# EAGLE design mult-mixer (EAGLE 9.1.0)
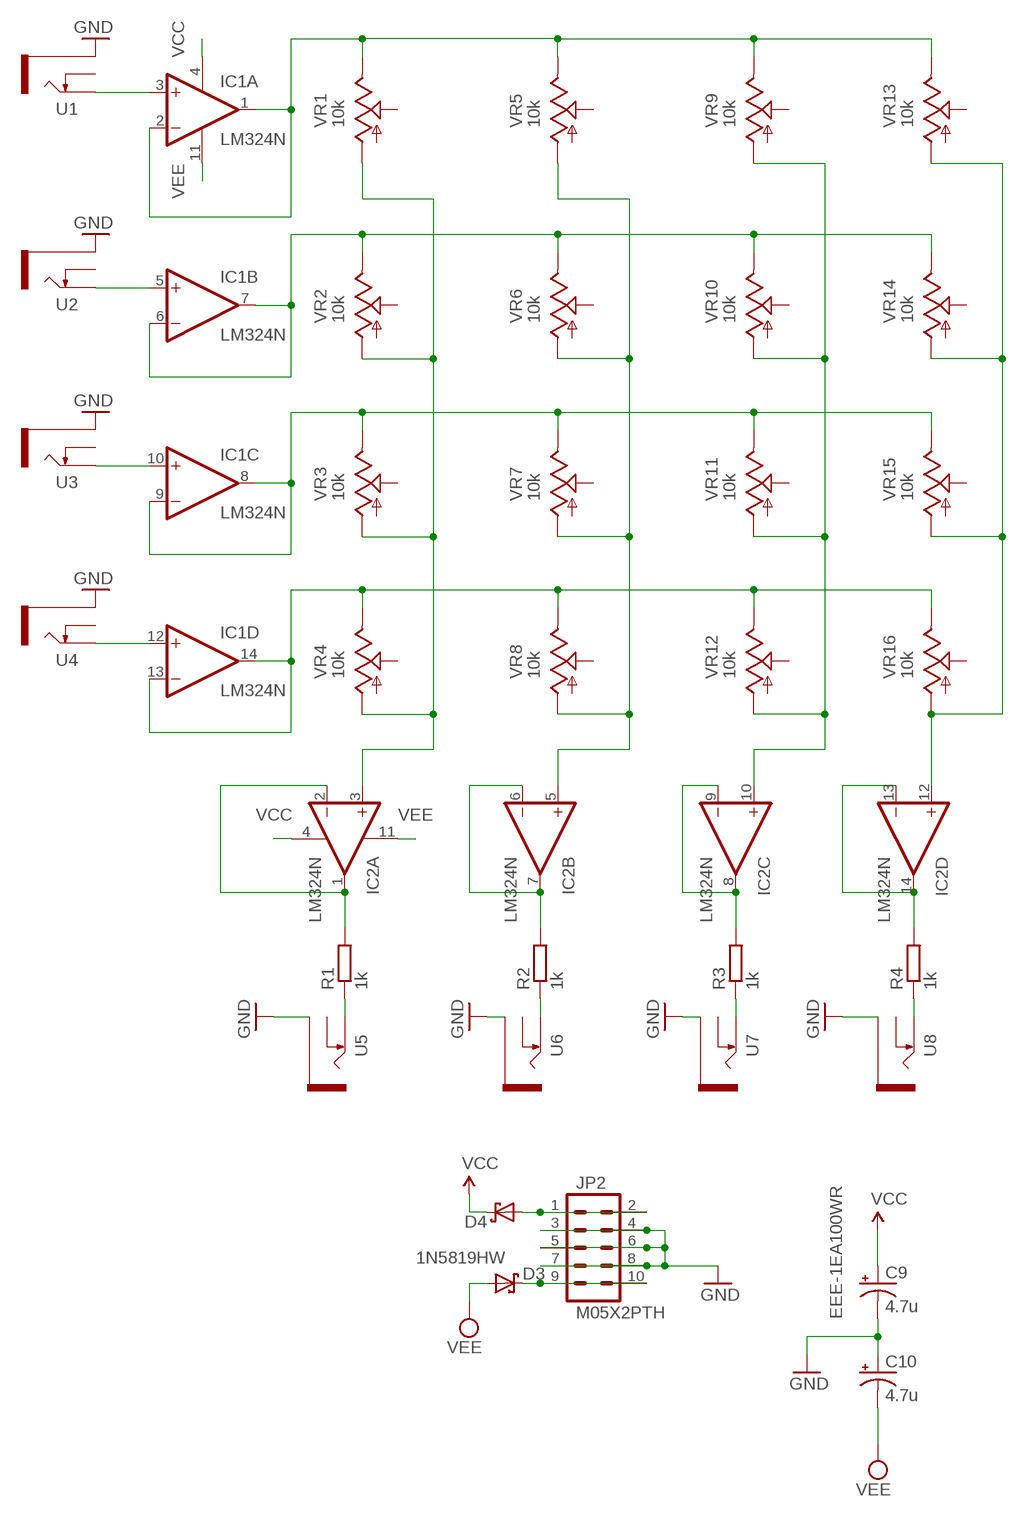
[diagram p0: schematic, sheet 1]

## Parts
C9  4.7u  CPOL-USA  [PANASONIC_A]
C10  4.7u  CPOL-USA  [PANASONIC_A]
D3  1N5819HW  1N5819-B  [DO41-7.6]
D4  1N5819HW  1N5819-B  [DO41-7.6]
IC1  LM324N  [DIL14]
IC2  LM324N  [DIL14]
JP2  M05X2PTH  [AVR_ICSP]
R1  1k  RESISTOR10MM_RESISTOR  [10MM_RESISTOR]
R2  1k  RESISTOR10MM_RESISTOR  [10MM_RESISTOR]
R3  1k  RESISTOR10MM_RESISTOR  [10MM_RESISTOR]
R4  1k  RESISTOR10MM_RESISTOR  [10MM_RESISTOR]
U1  THONKICONNNEW  [WQP-PJ301M-12_JACK]
U2  THONKICONNNEW  [WQP-PJ301M-12_JACK]
U3  THONKICONNNEW  [WQP-PJ301M-12_JACK]
U4  THONKICONNNEW  [WQP-PJ301M-12_JACK]
U5  THONKICONNNEW  [WQP-PJ301M-12_JACK]
U6  THONKICONNNEW  [WQP-PJ301M-12_JACK]
U7  THONKICONNNEW  [WQP-PJ301M-12_JACK]
U8  THONKICONNNEW  [WQP-PJ301M-12_JACK]
VR1  10k  9MM_SNAP-IN_POT_  [9MM_SNAP-IN_POT]
VR2  10k  9MM_SNAP-IN_POT_  [9MM_SNAP-IN_POT]
VR3  10k  9MM_SNAP-IN_POT_  [9MM_SNAP-IN_POT]
VR4  10k  9MM_SNAP-IN_POT_  [9MM_SNAP-IN_POT]
VR5  10k  9MM_SNAP-IN_POT_  [9MM_SNAP-IN_POT]
VR6  10k  9MM_SNAP-IN_POT_  [9MM_SNAP-IN_POT]
VR7  10k  9MM_SNAP-IN_POT_  [9MM_SNAP-IN_POT]
VR8  10k  9MM_SNAP-IN_POT_  [9MM_SNAP-IN_POT]
VR9  10k  9MM_SNAP-IN_POT_  [9MM_SNAP-IN_POT]
VR10  10k  9MM_SNAP-IN_POT_  [9MM_SNAP-IN_POT]
VR11  10k  9MM_SNAP-IN_POT_  [9MM_SNAP-IN_POT]
VR12  10k  9MM_SNAP-IN_POT_  [9MM_SNAP-IN_POT]
VR13  10k  9MM_SNAP-IN_POT_  [9MM_SNAP-IN_POT]
VR14  10k  9MM_SNAP-IN_POT_  [9MM_SNAP-IN_POT]
VR15  10k  9MM_SNAP-IN_POT_  [9MM_SNAP-IN_POT]
VR16  10k  9MM_SNAP-IN_POT_  [9MM_SNAP-IN_POT]

## Nets
GND: C9.- C10.+ JP2.3 JP2.4 JP2.5 JP2.6 JP2.7 JP2.8 U1.P$3_SLEEVE(SLEEVE) U2.P$3_SLEEVE(SLEEVE) U3.P$3_SLEEVE(SLEEVE) U4.P$3_SLEEVE(SLEEVE) U5.P$3_SLEEVE(SLEEVE) U6.P$3_SLEEVE(SLEEVE) U7.P$3_SLEEVE(SLEEVE) U8.P$3_SLEEVE(SLEEVE)
N$1: IC1.3(A:+IN) U1.P$1_TIP(TIP)
N$2: IC1.1(A:OUT) IC1.2(A:-IN) VR1.3(E) VR5.3(E) VR9.3(E) VR13.3(E)
N$3: IC1.5(B:+IN) U2.P$1_TIP(TIP)
N$4: IC1.10(C:+IN) U3.P$1_TIP(TIP)
N$5: IC1.12(D:+IN) U4.P$1_TIP(TIP)
N$7: IC1.6(B:-IN) IC1.7(B:OUT) VR2.3(E) VR6.3(E) VR10.3(E) VR14.3(E)
N$8: IC2.3(A:+IN) VR1.1(A) VR2.1(A) VR3.1(A) VR4.1(A)
N$9: IC2.1(A:OUT) IC2.2(A:-IN) R1.2
N$10: IC1.8(C:OUT) IC1.9(C:-IN) VR3.3(E) VR7.3(E) VR11.3(E) VR15.3(E)
N$11: IC1.13(D:-IN) IC1.14(D:OUT) VR4.3(E) VR8.3(E) VR12.3(E) VR16.3(E)
N$12: IC2.5(B:+IN) VR5.1(A) VR6.1(A) VR7.1(A) VR8.1(A)
N$13: IC2.6(B:-IN) IC2.7(B:OUT) R2.2
N$14: IC2.10(C:+IN) VR9.1(A) VR10.1(A) VR11.1(A) VR12.1(A)
N$15: IC2.8(C:OUT) IC2.9(C:-IN) R3.2
N$16: IC2.12(D:+IN) VR13.1(A) VR14.1(A) VR15.1(A) VR16.1(A)
N$17: IC2.13(D:-IN) IC2.14(D:OUT) R4.2
N$18: R1.1 U5.P$1_TIP(TIP)
N$19: R2.1 U6.P$1_TIP(TIP)
N$21: R3.1 U7.P$1_TIP(TIP)
N$22: R4.1 U8.P$1_TIP(TIP)
N$23: D4.A JP2.1 JP2.2
N$24: D3.C JP2.9 JP2.10
VCC: C9.+ D4.C IC1.4(P:V+) IC2.4(P:V+)
VEE: C10.- D3.A IC1.11(P:V-) IC2.11(P:V-)
Unconnected: U1.P$2_SWITCH(SWITCH) U2.P$2_SWITCH(SWITCH) U3.P$2_SWITCH(SWITCH) U4.P$2_SWITCH(SWITCH) U5.P$2_SWITCH(SWITCH) U6.P$2_SWITCH(SWITCH) U7.P$2_SWITCH(SWITCH) U8.P$2_SWITCH(SWITCH) VR1.2(S) VR2.2(S) VR3.2(S) VR4.2(S) VR5.2(S) VR6.2(S) VR7.2(S) VR8.2(S) VR9.2(S) VR10.2(S) VR11.2(S) VR12.2(S) VR13.2(S) VR14.2(S) VR15.2(S) VR16.2(S)

## Notes on the sheet
- EEE-1EA100WR

## Library data of the parts
C9 C10 = rcl:CPOL-US: POLARIZED CAPACITOR, American symbol
D3 D4 = diode:1N581*: 1.0A SCHOTTKY BARRIER RECTIFIER Source: http://www.diodes.com/datasheets/ds23001.pdf
IC1 IC2 = linear:LM324: OP AMP
JP2 = og-header:M05X2: Header 5x2 Standard 10-pin dual row 0.1" header. Commonly used with AVR-ISP. Use with Spark Fun Electronics SKU: PRT-00778
R1-R4 = MusicThingModular:RESISTOR: Standard resistor, various versions
U1-U8 = MusicThingModular:THONKICONN: 3.5mm socket for Eurorack modular synths
VR1-VR16 = MusicThingModular:9MM_SNAP-IN_POT: 9mm vertical snap-in pot, Alpha / Panasonic style

## Board
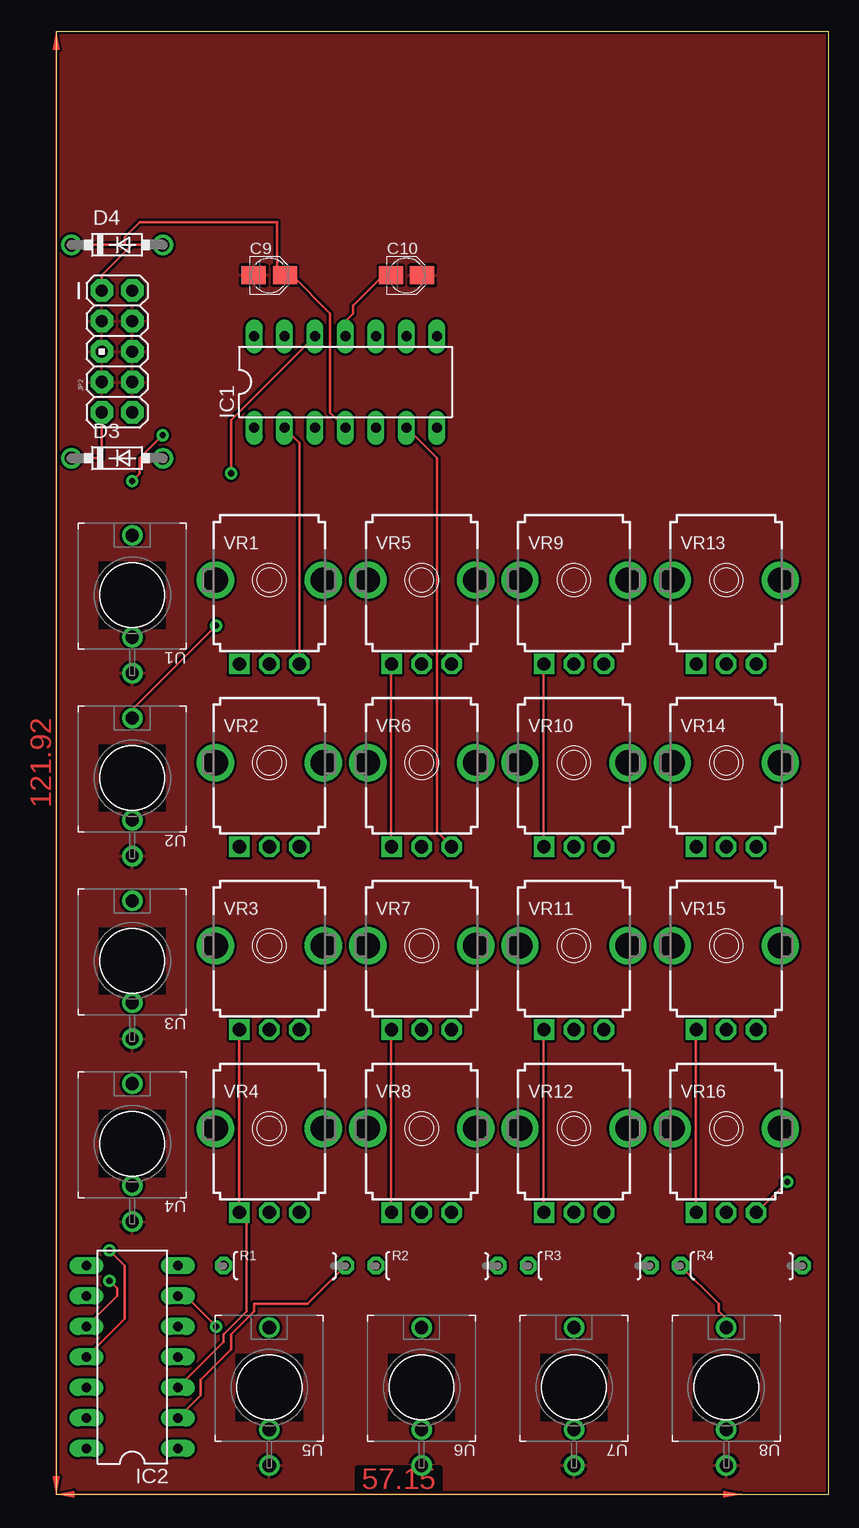
[diagram p1: board, top side]
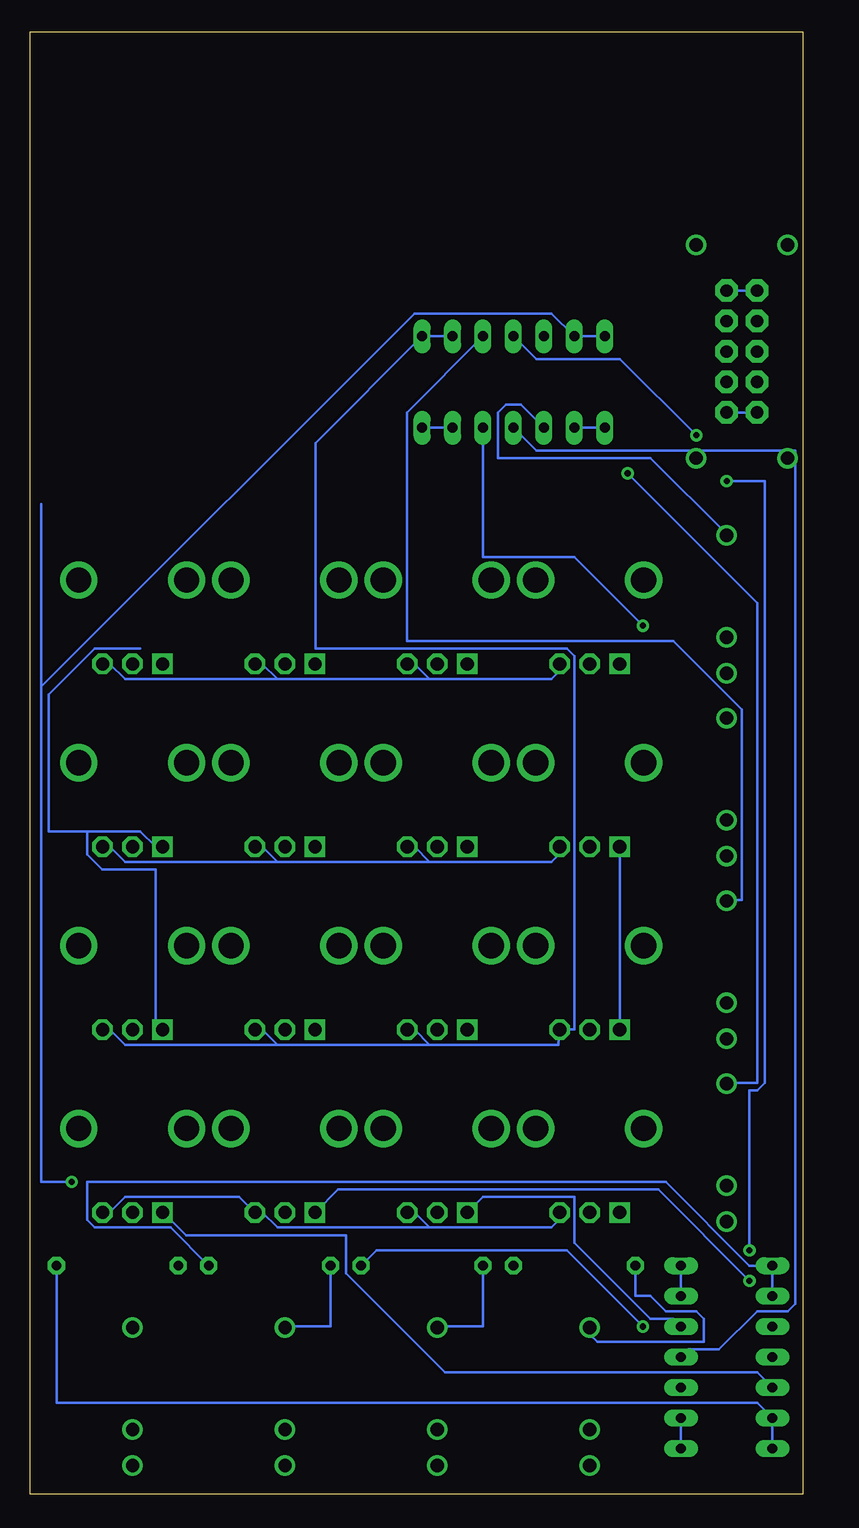
[diagram p2: board, bottom side, seen from below]

Size 64.44 x 121.91 mm. Coordinates in mm from the lower left corner, seen from the top.
Outline: 0,0 64.44,0 64.44,121.91 0,121.91 0,0
Copper layers (1*16): Top 0.035mm / dielectric 1.5mm / Bottom 0.035mm
Design rules "SparkFun": minimum track width 8mil, minimum drill 20mil, track to track 8mil, track to pad 8mil, pad to pad 8mil, via to via 8mil, smd to smd 8mil, copper to edge 8mil, drill to drill 8mil, minimum pad ring 12mil, minimum via ring 10mil, stop-mask expansion 4mil, vias tented up to drill 20mil, thermal gap 10mil

### Footprints (pad centres in the part's own frame; a part is rotated, then mirrored left to right if it is on the bottom)
PANASONIC_A = smd 2 x 1.5: + 1.3,0; - -1.3,0
DO41-7.6 = drill 1.1 pad 1.7: A 3.81,0; C -3.81,0
DIL14 = drill 0.813 long: 1 -7.62,-3.81; 2 -5.08,-3.81; 3 -2.54,-3.81; 4 0,-3.81; 5 2.54,-3.81; 6 5.08,-3.81; 7 7.62,-3.81; 8 7.62,3.81; 9 5.08,3.81; 10 2.54,3.81; 11 0,3.81; 12 -2.54,3.81; 13 -5.08,3.81; 14 -7.62,3.81
AVR_ICSP = drill 1.016 pad 1.88 octagon: 1 -1.27,5.08; 2 1.27,5.08; 3 -1.27,2.54; 4 1.27,2.54; 5 -1.27,0; 6 1.27,0; 7 -1.27,-2.54; 8 1.27,-2.54; 9 -1.27,-5.08; 10 1.27,-5.08
10MM_RESISTOR = drill 0.813 octagon: 1 -5.08,0; 2 5.08,0
WQP-PJ301M-12_JACK = drill 1.1: P$1_TIP 0,5; P$2_SWITCH 0,-3.5; P$3_SLEEVE 0,-6.5
9MM_SNAP-IN_POT = drill 1.1 square: 1 -2.5,-7 | drill 1.1 octagon: 2 0,-7; 3 2.5,-7 | drill 2.1 pad 2.794: CHASSIS1 -4.5,0; CHASSIS2 4.5,0

### Placement (x,y rotation side)
C9  17.78,101.6 0 top
C10  29.21,101.6 0 top
D3  5.08,86.36 0 top
D4  5.08,104.14 0 top
IC1  24.13,92.71 0 top
IC2  6.35,11.43 90 top
JP2  5.08,95.25 0 top
R1  19.05,19.05 0 top
R2  31.75,19.05 0 top
R3  44.45,19.05 0 top
R4  57.15,19.05 0 top
U1  6.35,74.93 0 top
U2  6.35,59.69 0 top
U3  6.35,44.45 0 top
U4  6.35,29.21 0 top
U5  17.78,8.89 0 top
U6  30.48,8.89 0 top
U7  43.18,8.89 0 top
U8  55.88,8.89 0 top
VR1  17.78,76.2 0 top
VR2  17.78,60.96 0 top
VR3  17.78,45.72 0 top
VR4  17.78,30.48 0 top
VR5  30.48,76.2 0 top
VR6  30.48,60.96 0 top
VR7  30.48,45.72 0 top
VR8  30.48,30.48 0 top
VR9  43.18,76.2 0 top
VR10  43.18,60.96 0 top
VR11  43.18,45.72 0 top
VR12  43.18,30.48 0 top
VR13  55.88,76.2 0 top
VR14  55.88,60.96 0 top
VR15  55.88,45.72 0 top
VR16  55.88,30.48 0 top

### Tracks (layer width: path | path; a pad name or v marks a point on that pad's centre or on a via)
GND
  pour Top: 0,121.92 0,0 64.77,0 64.77,121.92
N$1
  Bottom 0.203: IC1.3 23.5,90.81 24.77,90.81 25.4,90.17 25.4,86.36 12.7,86.36 6.35,80.01 U1.P$1_TIP
N$2
  Top 0.203: IC1.2 20.32,87.63 20.32,69.22 VR1.3
  Bottom 0.203: IC1.2 IC1.1 | 31.11,67.94 20.95,67.94 20.32,68.58 VR1.3 | 31.11,67.94 32.38,69.22 VR5.3 | 43.81,67.94 45.09,69.22 VR9.3 | 31.11,67.94 43.81,67.94 | 43.81,67.94 56.52,67.94 57.78,69.22 VR13.3
N$3  (via drill 0.51)
  Top 0.203: v13.34,72.39 6.35,65.41 U2.P$1_TIP
  Bottom 0.203: IC1.5 26.67,78.11 19.05,78.11 v13.34,72.39
N$4
  Bottom 0.203: IC1.10 33.02,90.17 33.02,71.12 10.79,71.12 5.08,65.41 5.08,49.53 6.35,49.53 U3.P$1_TIP
N$5  (via drill 0.51)
  Top 0.203: IC1.12 14.61,89.53 v14.61,85.09
  Bottom 0.203: v14.61,85.09 3.81,74.3 3.81,34.29 6.35,34.29 U4.P$1_TIP
N$7
  Top 0.203: IC1.6 31.75,86.36 31.75,55.24 32.38,54.61 32.38,53.98 VR6.3
  Bottom 0.203: IC1.7 IC1.6 | 31.11,52.7 20.95,52.7 20.32,53.34 VR2.3 | 31.11,52.7 32.38,53.98 VR6.3 | 43.81,52.7 45.09,53.98 VR10.3 | 31.11,52.7 43.81,52.7 | 43.81,52.7 56.52,52.7 57.78,53.98 VR14.3
N$8
  Top 0.203: IC2.3 13.97,12.7 13.97,13.34 15.88,15.24 15.88,22.86 VR4.1 VR3.1
  Bottom 0.203: VR3.1 15.24,38.73 15.24,53.34 VR2.1
N$9
  Top 0.203: R1.2 20.95,15.88 16.51,15.88 16.51,15.24 14.61,13.34 14.61,12.06 12.06,9.53 12.06,8.26 IC2.2
  Bottom 0.203: IC2.2 IC2.1
N$10
  Bottom 0.203: IC1.9 IC1.8 40.64,87.63 40.64,70.48 19.68,70.48 19.05,69.85 19.05,38.73 19.68,38.73 VR3.3 20.36,37.47 31.11,37.47 | 31.11,37.47 32.38,38.73 VR7.3 | 43.81,37.47 45.09,38.73 VR11.3 | 31.11,37.47 43.81,37.47 | 43.81,37.47 56.52,37.47 57.78,38.73 VR15.3
N$11  (via drill 0.51)
  Top 0.203: v60.96,26.04 58.42,23.5 VR16.3
  Bottom 0.203: IC1.14 IC1.13 20.95,98.42 32.38,98.42 63.5,67.31 63.5,26.04 | 31.11,22.23 20.95,22.23 20.32,22.86 VR4.3 | 31.11,22.23 32.38,23.5 VR8.3 | 31.11,22.23 43.81,22.23 45.09,23.5 VR12.3 45.72,23.5 46.99,24.77 56.52,24.77 57.78,23.5 VR16.3 | v60.96,26.04 63.5,26.04 | 63.5,26.04 63.5,82.55
N$12
  Top 0.203: VR7.1 27.94,38.1 27.94,23.5 VR8.1 | VR5.1 27.94,68.58 27.94,53.98 VR6.1
  Bottom 0.203: IC2.5 10.79,14.61 12.7,14.61 19.05,20.95 19.05,24.77 26.67,24.77 27.94,23.5 VR8.1
N$13  (via drill 0.51)
  Top 0.203: v13.34,13.97 10.79,16.51 IC2.6
  Bottom 0.203: IC2.7 IC2.6 | R2.2 35.56,20.32 19.68,20.32 v13.34,13.97
N$14  (via drill 0.51)
  Top 0.203: IC2.10 5.08,16.51 5.08,17.14 v4.45,17.78 | VR11.1 40.64,38.1 40.64,23.5 VR12.1 | VR9.1 40.64,68.58 40.64,53.98 VR10.1
  Bottom 0.203: v4.45,17.78 12.06,25.4 38.73,25.4 40.64,23.5 VR12.1
N$15
  Bottom 0.203: IC2.9 IC2.8 4.45,19.05 11.43,26.04 59.69,26.04 59.69,22.86 59.05,22.23 52.7,22.23 R3.2
N$16
  Top 0.203: VR15.1 53.34,38.1 53.34,23.5 VR16.1
  Bottom 0.203: 59.69,55.24 59.69,53.34 58.42,52.07 53.98,52.07 53.98,38.73 VR15.1 | 59.69,55.24 55.24,55.24 53.98,53.98 VR14.1 | 55.24,70.48 59.05,70.48 62.87,66.67 62.87,55.24 59.69,55.24 | IC2.12 3.81,10.16 29.84,10.16 38.1,18.41 38.1,21.59 51.44,21.59 52.7,22.86 53.34,22.86 VR16.1
N$17
  Bottom 0.203: IC2.14 IC2.13 3.81,7.62 62.23,7.62 R4.2
N$18
  Bottom 0.203: R1.1 13.97,16.51 12.7,16.51 11.43,15.24 8.89,15.24 8.26,14.61 8.26,12.7 17.14,12.7 17.78,13.34 U5.P$1_TIP
N$19
  Bottom 0.203: R2.1 26.67,13.97 30.48,13.97 U6.P$1_TIP
N$21
  Bottom 0.203: R3.1 39.37,13.97 43.18,13.97 U7.P$1_TIP
N$22
  Top 0.203: R4.1 55.24,15.88 55.24,15.24 55.88,14.61 U8.P$1_TIP
N$23
  Top 0.203: JP2.1 3.81,101.6 6.35,104.14 D4.A
  Bottom 0.203: JP2.1 JP2.2
N$24
  Top 0.203: JP2.9 3.81,86.36 D3.C
  Bottom 0.203: JP2.9 JP2.10
VCC
  Top 0.203: D4.C 5.71,104.14 5.71,104.78 6.99,106.05 18.41,106.05 18.41,102.23 19.05,101.6 C9.+ 19.68,101.6 22.86,98.42 22.86,90.17 IC1.4
  Bottom 0.203: IC2.4 9.53,12.06 6.99,12.06 3.81,15.24 1.27,15.24 0.64,15.88 0.64,87 | 0.64,87 22.23,87 IC1.4 | 0.64,87 0.64,31.11
VEE  (via drill 0.51)
  Top 0.203: v8.89,88.27 6.99,86.36 | IC1.11 24.13,97.79 24.77,98.42 24.77,99.06 27.3,101.6 C10.- | IC2.11 5.71,14.61 5.71,19.05 v4.45,20.32 | v6.35,84.45 6.99,85.09 6.99,86.36 | 6.99,86.36 D3.A
  Bottom 0.203: v8.89,88.27 15.24,94.61 22.23,94.61 IC1.11 | v4.45,20.32 4.45,33.66 3.81,33.66 3.17,34.29 3.17,84.45 v6.35,84.45
(copper drawn outside any net)
  shapes: Top area x2